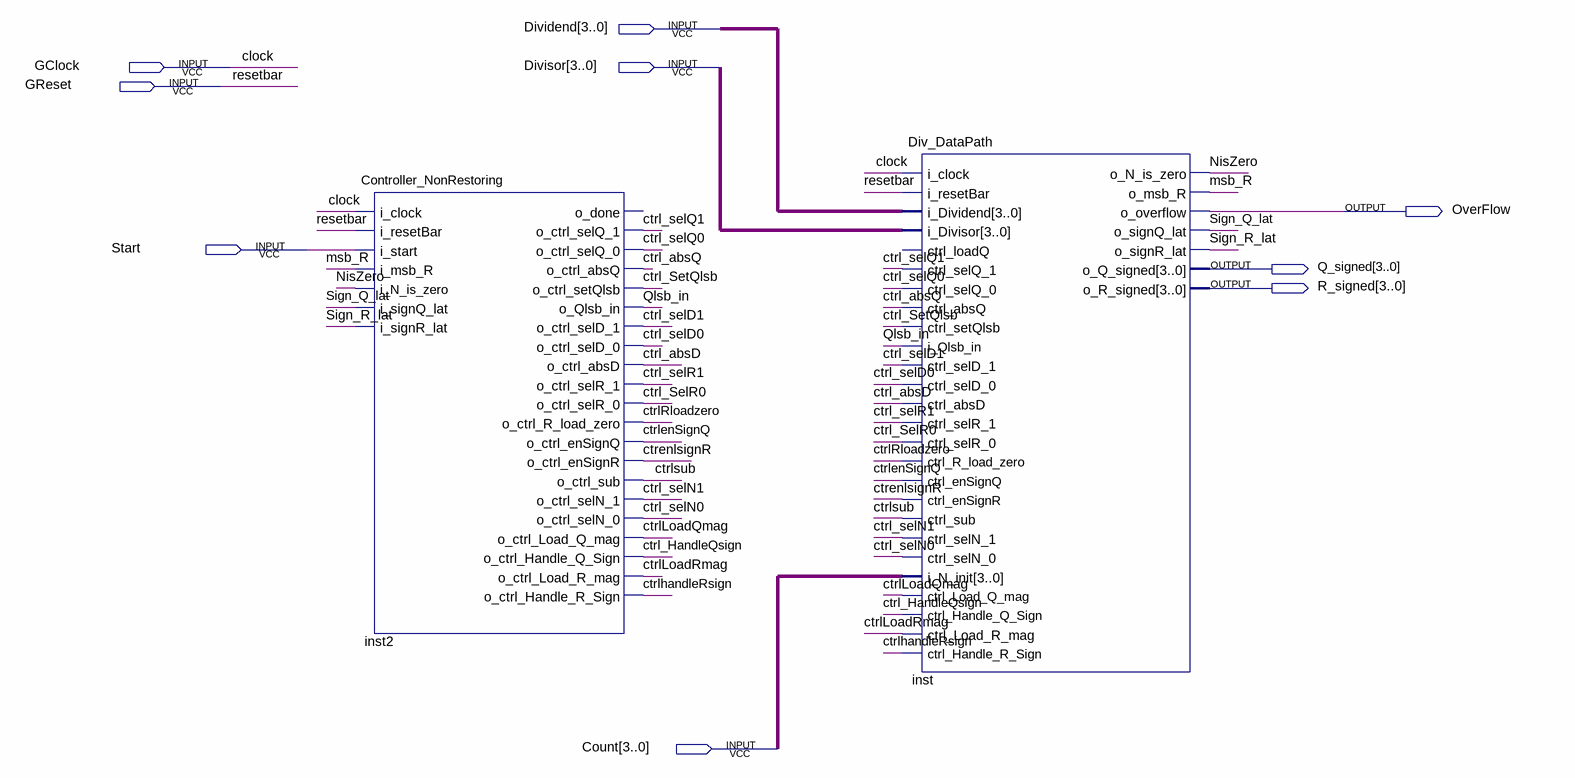
[diagram p0: schematic sheet]
// Quartus schematic Division.bdf as structural Verilog: 2 symbols, 9 pins
module Division (
  input  [3:0] Dividend,
  input  GClock,
  input  [3:0] Divisor,
  input  GReset,
  input  Start,
  input  [3:0] Count,
  output OverFlow,
  output [3:0] Q_signed,
  output [3:0] R_signed
);

  wire ctrenlsignR, ctrl_absD, ctrl_absQ, ctrl_HandleQsign, ctrl_selD0, ctrl_selD1, ctrl_selN0, ctrl_selN1,
       ctrl_selQ0, ctrl_selQ1, ctrl_SelR0, ctrl_selR1, ctrl_SetQlsb, ctrlenSignQ, ctrlhandleRsign,
       ctrlLoadQmag, ctrlLoadRmag, ctrlRloadzero, ctrlsub, msb_R, NisZero, Qlsb_in, Sign_Q_lat, Sign_R_lat;

  Controller_NonRestoring inst2 (
    .i_clock(GClock), .i_resetBar(GReset), .i_start(Start), .i_msb_R(msb_R), .i_N_is_zero(NisZero),
    .i_signQ_lat(Sign_Q_lat), .i_signR_lat(Sign_R_lat), .o_ctrl_selQ_1(ctrl_selQ1),
    .o_ctrl_selQ_0(ctrl_selQ0), .o_ctrl_absQ(ctrl_absQ), .o_ctrl_setQlsb(ctrl_SetQlsb), .o_Qlsb_in(Qlsb_in),
    .o_ctrl_selD_1(ctrl_selD1), .o_ctrl_selD_0(ctrl_selD0), .o_ctrl_absD(ctrl_absD),
    .o_ctrl_selR_1(ctrl_selR1), .o_ctrl_selR_0(ctrl_SelR0), .o_ctrl_R_load_zero(ctrlRloadzero),
    .o_ctrl_enSignQ(ctrlenSignQ), .o_ctrl_enSignR(ctrenlsignR), .o_ctrl_sub(ctrlsub),
    .o_ctrl_selN_1(ctrl_selN1), .o_ctrl_selN_0(ctrl_selN0), .o_ctrl_Load_Q_mag(ctrlLoadQmag),
    .o_ctrl_Handle_Q_Sign(ctrl_HandleQsign), .o_ctrl_Load_R_mag(ctrlLoadRmag),
    .o_ctrl_Handle_R_Sign(ctrlhandleRsign));  // open: o_done
  Div_DataPath inst (
    .i_clock(GClock), .i_resetBar(GReset), .i_Dividend(Dividend), .i_Divisor(Divisor),
    .ctrl_selQ_1(ctrl_selQ1), .ctrl_selQ_0(ctrl_selQ0), .ctrl_absQ(ctrl_absQ), .ctrl_setQlsb(ctrl_SetQlsb),
    .i_Qlsb_in(Qlsb_in), .ctrl_selD_1(ctrl_selD1), .ctrl_selD_0(ctrl_selD0), .ctrl_absD(ctrl_absD),
    .ctrl_selR_1(ctrl_selR1), .ctrl_selR_0(ctrl_SelR0), .ctrl_R_load_zero(ctrlRloadzero),
    .ctrl_enSignQ(ctrlenSignQ), .ctrl_enSignR(ctrenlsignR), .ctrl_sub(ctrlsub), .ctrl_selN_1(ctrl_selN1),
    .ctrl_selN_0(ctrl_selN0), .i_N_init(Count), .ctrl_Load_Q_mag(ctrlLoadQmag),
    .ctrl_Handle_Q_Sign(ctrl_HandleQsign), .ctrl_Load_R_mag(ctrlLoadRmag),
    .ctrl_Handle_R_Sign(ctrlhandleRsign), .o_N_is_zero(NisZero), .o_msb_R(msb_R), .o_overflow(OverFlow),
    .o_signQ_lat(Sign_Q_lat), .o_signR_lat(Sign_R_lat), .o_Q_signed(Q_signed), .o_R_signed(R_signed));  // open: ctrl_loadQ

  // Other names for the same wires on the sheet: clock = GClock; resetbar = GReset
endmodule
